# EAGLE design coupon (EAGLE 6.2)
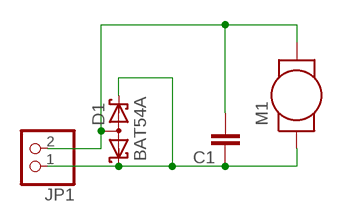
[diagram p0: schematic, sheet 1]

## Parts
C1  C-EUC0805  [C0805]
D1  BAT54A  [SOT23]
JP1  PINHD-1X2  [1X02]
M1  PAGER-PANCAKE  [PANCAKE]

## Nets
GND: C1.1 D1.1(K1) D1.2(K2) JP1.1 M1.P$1
N$1: C1.2 D1.3(AA) JP1.2 M1.P$2

## Library data of the parts
C1 = rcl:C-EU: CAPACITOR, European symbol
D1 = diode:BAT54A: Schottky Diodes Source: Fairchild .. BAT54.pdf
JP1 = pinhead:PINHD-1X2: PIN HEADER
M1 = alex:PAGER-PANCAKE

## Board
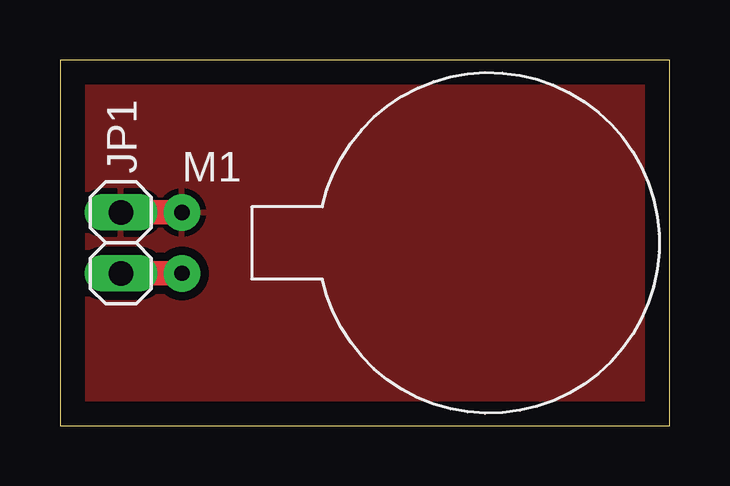
[diagram p1: board, top side]
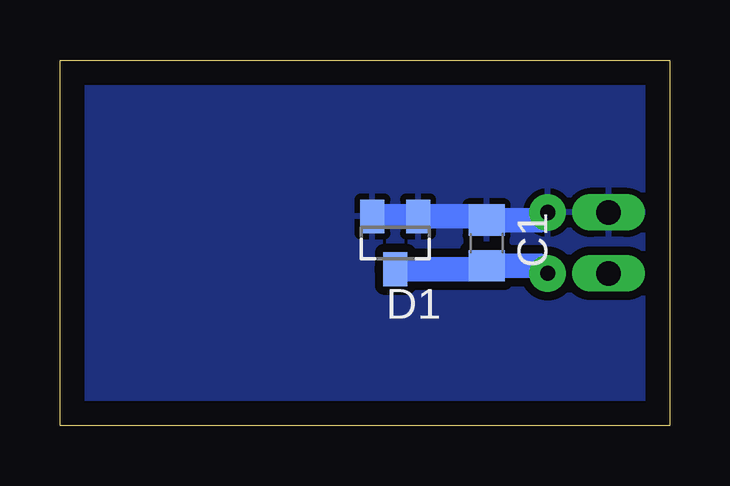
[diagram p2: board, bottom side, seen from below]

Size 25.4 x 15.24 mm. Coordinates in mm from the lower left corner, seen from the top.
Outline: 0,0 25.4,0 25.4,15.24 0,15.24 0,0
Copper layers (1*16): Top 0.035mm / dielectric 1.5mm / Bottom 0.035mm
Design rules: minimum track width 10mil, minimum drill 24mil, track to track 8mil, track to pad 8mil, pad to pad 8mil, via to via 8mil, smd to smd 8mil, copper to edge 40mil, drill to drill 8mil, minimum pad ring 10mil, minimum via ring 8mil, stop-mask expansion 4mil, vias tented up to drill 0mil, thermal gap 10mil

### Footprints (pad centres in the part's own frame; a part is rotated, then mirrored left to right if it is on the bottom)
C0805 = smd 1.3 x 1.5: 1 -0.95,0; 2 0.95,0
SOT23 = smd 1 x 1.4: 1 -0.95,-1.1; 2 0.95,-1.1; 3 0,1.1
1X02 = drill 1.016 long: 1 -1.27,0; 2 1.27,0
PANCAKE = drill 0.635 pad 1.524: P$1 -12.7,1.27; P$2 -12.7,-1.27

### Placement (x,y rotation side)
C1  7.62,7.62 270 bottom
D1  11.43,7.62 180 bottom
JP1  2.54,7.62 270 top
M1  17.78,7.62 0 top

### Tracks (layer width: path | path; a pad name or v marks a point on that pad's centre or on a via)
GND
  Top 1.016: JP1.1 M1.P$1
  Bottom 1.016: M1.P$1 5.4,8.57 C1.1 7.77,8.72 D1.1 D1.2
  pour Top (isolate 0.356): 0.13,15.11 25.27,15.11 25.27,0.13 0.13,0.13
  pour Bottom (isolate 0.356): 0.13,15.11 25.27,15.11 25.27,0.13 0.13,0.13
N$1
  Top 1.016: JP1.2 M1.P$2
  Bottom 1.016: M1.P$2 5.4,6.67 C1.2 7.77,6.52 D1.3